# EAGLE design mainboard-dev (EAGLE 6.4)
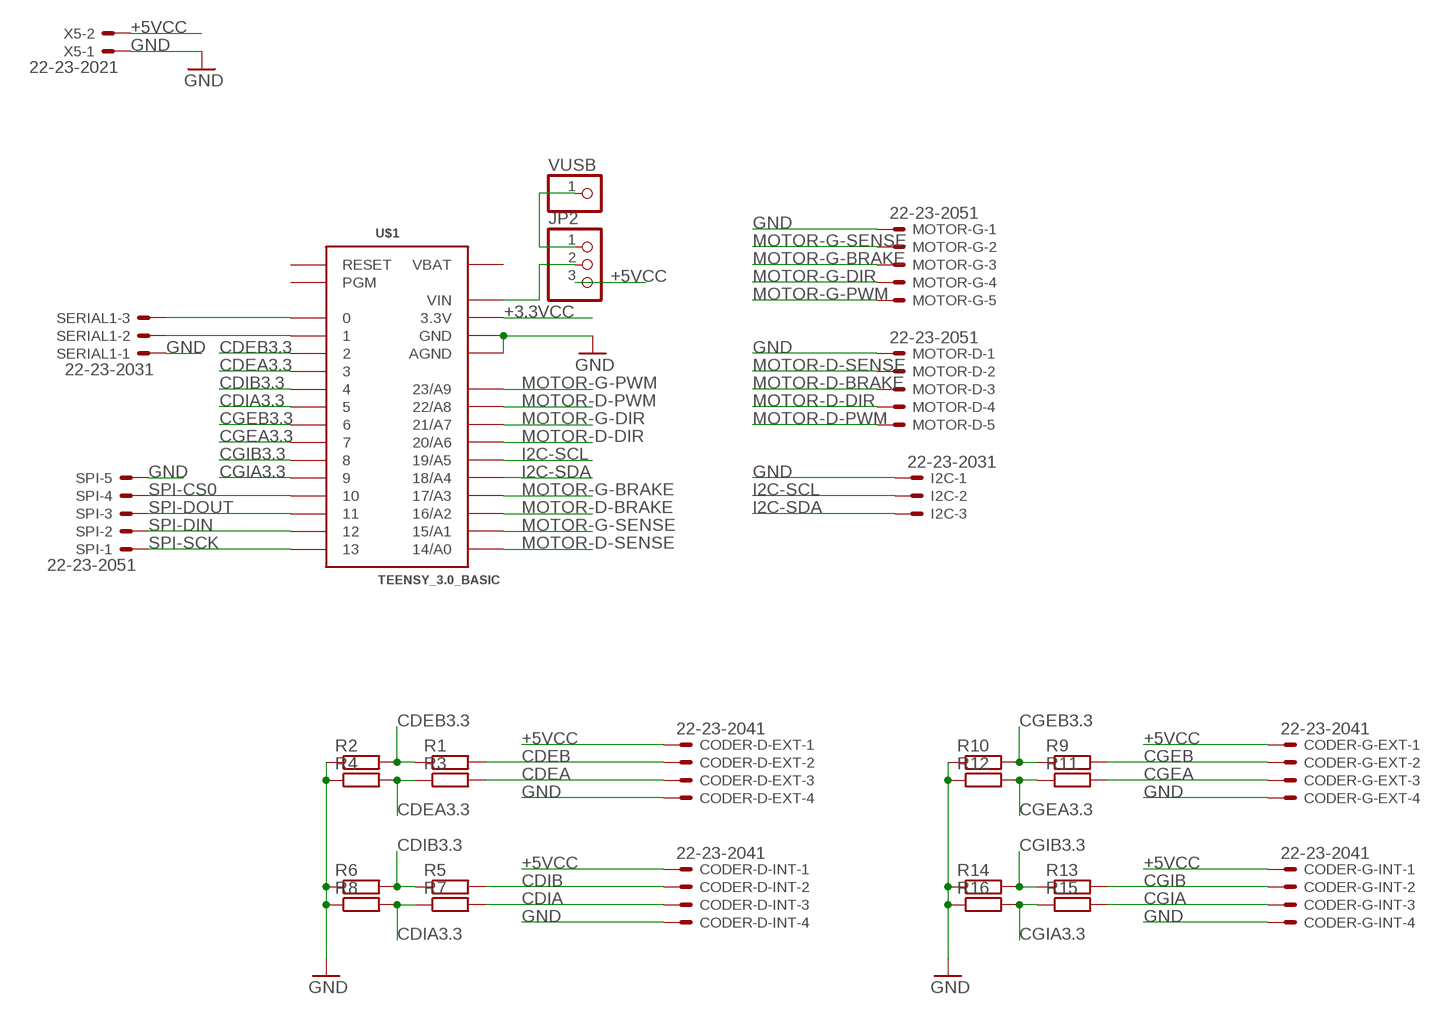
[diagram p0: schematic, sheet 1]

## Parts
CODER-D-EXT  22-23-2041  [22-23-2041]
CODER-D-INT  22-23-2041  [22-23-2041]
CODER-G-EXT  22-23-2041  [22-23-2041]
CODER-G-INT  22-23-2041  [22-23-2041]
I2C  22-23-2031  [22-23-2031]
JP2  PINHD-1X3  [1X03]
MOTOR-D  22-23-2051  [22-23-2051]
MOTOR-G  22-23-2051  [22-23-2051]
R1  R-EU_0207/10  [0207/10]
R2  R-EU_0207/10  [0207/10]
R3  R-EU_0207/10  [0207/10]
R4  R-EU_0207/10  [0207/10]
R5  R-EU_0207/10  [0207/10]
R6  R-EU_0207/10  [0207/10]
R7  R-EU_0207/10  [0207/10]
R8  R-EU_0207/10  [0207/10]
R9  R-EU_0207/10  [0207/10]
R10  R-EU_0207/10  [0207/10]
R11  R-EU_0207/10  [0207/10]
R12  R-EU_0207/10  [0207/10]
R13  R-EU_0207/10  [0207/10]
R14  R-EU_0207/10  [0207/10]
R15  R-EU_0207/10  [0207/10]
R16  R-EU_0207/10  [0207/10]
SERIAL1  22-23-2031  [22-23-2031]
SPI  22-23-2051  [22-23-2051]
U$1  TEENSY_3.0_BASIC  [TEENSY_3.0_BASIC]
VUSB  PINHD-1X1  [1X01]
X5  22-23-2021  [22-23-2021]

## Nets
+3.3VCC: U$1.3.3V U$1.3.3V1(3.3V)
+5VCC: CODER-D-EXT.1 CODER-D-INT.1 CODER-G-EXT.1 CODER-G-INT.1 JP2.3 X5.2
CDEA: CODER-D-EXT.3 R3.2
CDEA3.3: R3.1 R4.2 U$1.3
CDEB: CODER-D-EXT.2 R1.2
CDEB3.3: R1.1 R2.2 U$1.2
CDIA: CODER-D-INT.3 R7.2
CDIA3.3: R7.1 R8.2 U$1.5
CDIB: CODER-D-INT.2 R5.2
CDIB3.3: R5.1 R6.2 U$1.4
CGEA: CODER-G-EXT.3 R11.2
CGEA3.3: R11.1 R12.2 U$1.7
CGEB: CODER-G-EXT.2 R9.2
CGEB3.3: R9.1 R10.2 U$1.6
CGIA: CODER-G-INT.3 R15.2
CGIA3.3: R15.1 R16.2 U$1.9
CGIB: CODER-G-INT.2 R13.2
CGIB3.3: R13.1 R14.2 U$1.8
GND: CODER-D-EXT.4 CODER-D-INT.4 CODER-G-EXT.4 CODER-G-INT.4 I2C.1 MOTOR-D.1 MOTOR-G.1 R2.1 R4.1 R6.1 R8.1 R10.1 R12.1 R14.1 R16.1 SERIAL1.1 SPI.5 U$1.AGND U$1.GND U$1.GND1(GND) X5.1
I2C-SCL: I2C.2 U$1.19/A5
I2C-SDA: I2C.3 U$1.18/A4
MOTOR-D-BRAKE: MOTOR-D.3 U$1.16/A2
MOTOR-D-DIR: MOTOR-D.4 U$1.20/A6
MOTOR-D-PWM: MOTOR-D.5 U$1.22/A8
MOTOR-D-SENSE: MOTOR-D.2 U$1.14/A0
MOTOR-G-BRAKE: MOTOR-G.3 U$1.17/A3
MOTOR-G-DIR: MOTOR-G.4 U$1.21/A7
MOTOR-G-PWM: MOTOR-G.5 U$1.23/A9
MOTOR-G-SENSE: MOTOR-G.2 U$1.15/A1
N$1: SERIAL1.3 U$1.0
N$2: SERIAL1.2 U$1.1
N$3: JP2.2 U$1.VIN
N$4: JP2.1 VUSB.1
SPI-CS0: SPI.4 U$1.10
SPI-DIN: SPI.2 U$1.12
SPI-DOUT: SPI.3 U$1.11
SPI-SCK: SPI.1 U$1.13
Unconnected: U$1.PGM U$1.RESET

## Power pins joined to a net without a drawn wire
VBAT: U$1.VBAT

## Library data of the parts
CODER-D-EXT CODER-D-INT CODER-G-EXT CODER-G-INT = con-molex:22-23-2041: .100" (2.54mm) Center Header - 4 Pin; MF: MOLEX; MPN: 22-23-2041; OC_FARNELL: 1462920; OC_NEWARK: 38C0355
I2C SERIAL1 = con-molex:22-23-2031: .100" (2.54mm) Center Header - 3 Pin; MF: MOLEX; MPN: 22-23-2031; OC_FARNELL: 1462950; OC_NEWARK: 30C0862
JP2 = pinhead:PINHD-1X3: PIN HEADER
MOTOR-D MOTOR-G SPI = con-molex:22-23-2051: .100" (2.54mm) Center Header - 5 Pin; MF: MOLEX; MPN: 22-23-2051; OC_FARNELL: 1462952; OC_NEWARK: 38C9178
R1-R16 = rcl:R-EU_: RESISTOR, European symbol
U$1 = Teensy3.0:TEENSY_3.0_BASIC: Basic Teensy 3.0 with none of the 'inner' pins enabled. See '+4', 'AllAnalogPins", and 'AllPins' packages for additional pin holes, as needed.
VUSB = pinhead:PINHD-1X1: PIN HEADER
X5 = con-molex:22-23-2021: .100" (2.54mm) Center Header - 2 Pin; MF: MOLEX; MPN: 22-23-2021; OC_FARNELL: 1462926; OC_NEWARK: 25C3832

## Board
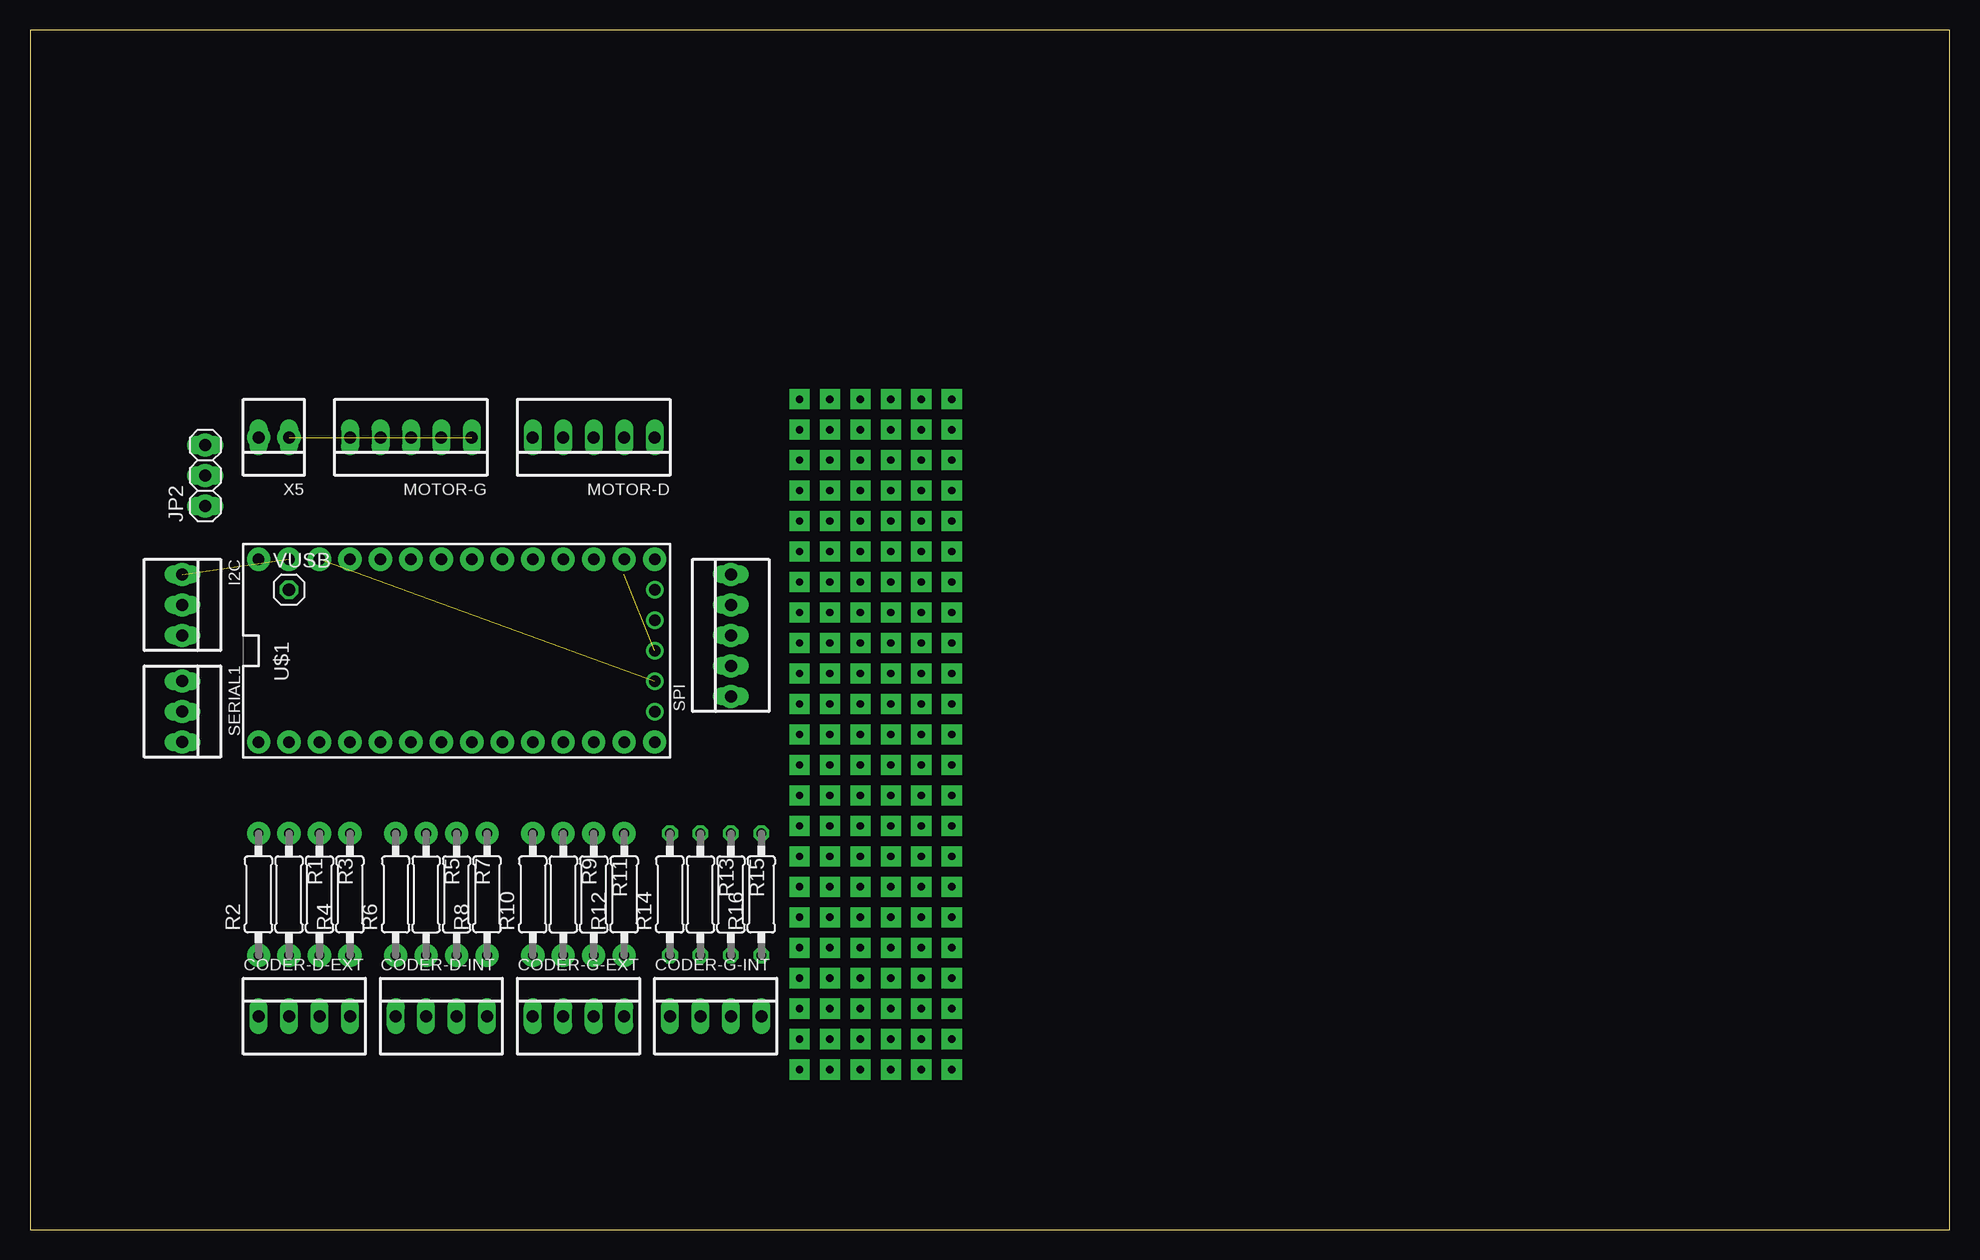
[diagram p1: board, top side]
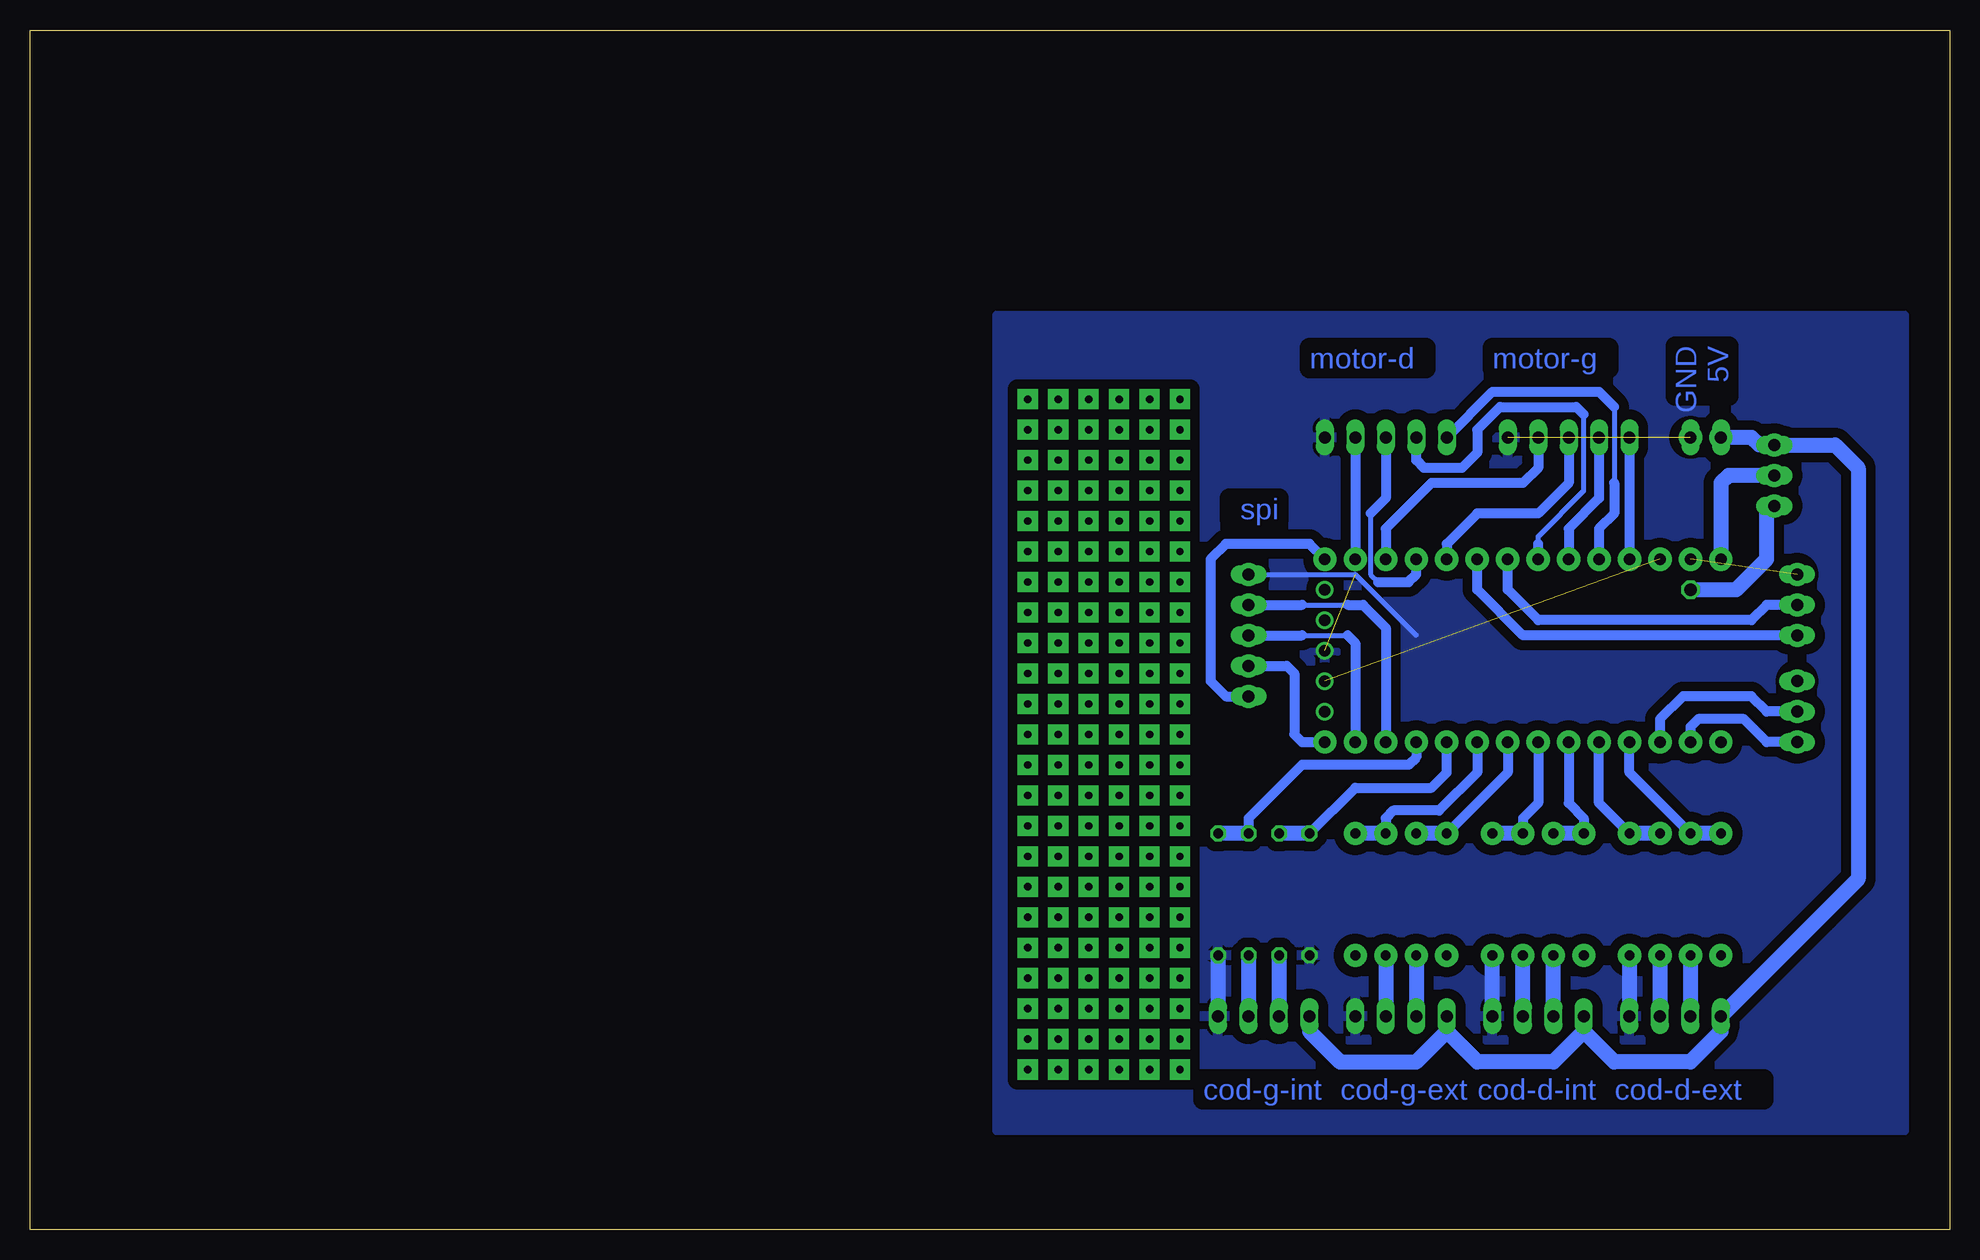
[diagram p2: board, bottom side, seen from below]

Size 160 x 100 mm. Coordinates in mm from the lower left corner, seen from the top.
Outline: 0,0 160,0 160,100 0,100 0,0
Copper layers (1*16): Top 0.035mm / dielectric 1.5mm / Bottom 0.035mm
Design rules "default": minimum track width 10mil, minimum drill 24mil, track to track 8mil, track to pad 8mil, pad to pad 8mil, via to via 8mil, smd to smd 8mil, copper to edge 40mil, drill to drill 8mil, minimum pad ring 10mil, minimum via ring 8mil, stop-mask expansion 4mil, vias tented up to drill 0mil, thermal gap 10mil

### Footprints (pad centres in the part's own frame; a part is rotated, then mirrored left to right if it is on the bottom)
22-23-2041 = drill 1 long: 1 -3.81,0; 2 -1.27,0; 3 1.27,0; 4 3.81,0
22-23-2031 = drill 1 long: 1 -2.54,0; 2 0,0; 3 2.54,0
1X03 = drill 1.016 long: 1 -2.54,0; 2 0,0; 3 2.54,0
22-23-2051 = drill 1 long: 1 -5.08,0; 2 -2.54,0; 3 0,0; 4 2.54,0; 5 5.08,0
0207/10 = drill 0.813 octagon: 1 -5.08,0; 2 5.08,0
TEENSY_3.0_BASIC = drill 0.965: 0 -7.62,13.97; 1 -7.62,11.43; 2 -7.62,8.89; 3 -7.62,6.35; 3.3V 7.62,11.43; 3.3V1 -2.54,-16.51; 4 -7.62,3.81; 5 -7.62,1.27; 6 -7.62,-1.27; 7 -7.62,-3.81; 8 -7.62,-6.35; 9 -7.62,-8.89; 10 -7.62,-11.43; 11 -7.62,-13.97; 12 -7.62,-16.51; 13 7.62,-16.51; 14/A0 7.62,-13.97; 15/A1 7.62,-11.43; 16/A2 7.62,-8.89; 17/A3 7.62,-6.35; 18/A4 7.62,-3.81; 19/A5 7.62,-1.27; 20/A6 7.62,1.27; 21/A7 7.62,3.81; 22/A8 7.62,6.35; 23/A9 7.62,8.89; AGND 7.62,13.97; GND -7.62,16.51; GND1 0,-16.51; PGM 2.54,-16.51; RESET 5.08,-16.51; VBAT -5.08,-16.51; VIN 7.62,16.51
1X01 = drill 1.016 octagon: 1 0,0
22-23-2021 = drill 1 long: 1 -1.27,0; 2 1.27,0

### Placement (x,y rotation side)
CODER-D-EXT  22.86,17.78 0 top
CODER-D-INT  34.29,17.78 0 top
CODER-G-EXT  45.72,17.78 0 top
CODER-G-INT  57.15,17.78 0 top
I2C  12.7,52.07 270 top
JP2  14.61,62.87 90 top
MOTOR-D  46.99,66.04 180 top
MOTOR-G  31.75,66.04 180 top
R1  21.59,27.94 270 top
R2  19.05,27.94 90 top
R3  24.13,27.94 270 top
R4  26.67,27.94 90 top
R5  33.02,27.94 270 top
R6  30.48,27.94 90 top
R7  35.56,27.94 270 top
R8  38.1,27.94 90 top
R9  44.45,27.94 270 top
R10  41.91,27.94 90 top
R11  46.99,27.94 270 top
R12  49.53,27.94 90 top
R13  55.88,27.94 270 top
R14  53.34,27.94 90 top
R15  58.42,27.94 270 top
R16  60.96,27.94 90 top
SERIAL1  12.7,43.18 270 top
SPI  58.42,49.53 90 top
U$1  35.56,48.26 90 top
VUSB  21.59,53.34 0 top
X5  20.32,66.04 180 top

### Tracks (layer width: path | path; a pad name or v marks a point on that pad's centre or on a via)
+3.3VCC  (1 unrouted)
+5VCC
  Bottom 1.27: X5.2 16.51,66.04 15.88,65.41 JP2.3 9.53,65.41 7.62,63.5 7.62,29.21 CODER-D-EXT.1 19.05,16.51 21.59,13.97 27.94,13.97 30.48,16.51 | CODER-G-INT.1 53.34,16.51 50.8,13.97 44.45,13.97 41.91,16.51 | 41.91,16.51 CODER-G-EXT.1 | CODER-D-INT.1 30.48,16.51 | 30.48,16.51 33.02,13.97 39.37,13.97 41.91,16.51
CDEA
  Bottom 1.27: R3.2 CODER-D-EXT.3
CDEA3.3
  Bottom 0.813: R4.2 29.21,35.56 U$1.3
  Bottom 1.27: R3.1 R4.2
CDEB
  Bottom 1.27: R1.2 CODER-D-EXT.2
CDEB3.3
  Bottom 0.813: R1.1 26.67,38.1 U$1.2
  Bottom 1.27: R2.2 R1.1
CDIA
  Bottom 1.27: CODER-D-INT.3 R7.2
CDIA3.3
  Bottom 0.813: U$1.5 34.29,35.56 35.56,34.29 R7.1
  Bottom 1.27: R7.1 R8.2
CDIB
  Bottom 1.27: CODER-D-INT.2 R5.2
CDIB3.3
  Bottom 0.813: U$1.4 31.75,35.56 30.48,34.29 R6.2
  Bottom 1.27: R6.2 R5.1
CGEA
  Bottom 1.27: R11.2 CODER-G-EXT.3
CGEA3.3
  Bottom 0.813: U$1.7 39.37,38.1 42.55,34.92 46.35,34.92 46.99,34.29 R11.1
  Bottom 1.27: R11.1 R12.2
CGEB
  Bottom 1.27: R9.2 CODER-G-EXT.2
CGEB3.3
  Bottom 0.813: U$1.6 36.83,38.1 R10.2
  Bottom 1.27: R10.2 R9.1
CGIA
  Bottom 1.27: R15.2 CODER-G-INT.3
CGIA3.3
  Bottom 0.813: U$1.9 44.45,39.37 45.09,38.73 53.98,38.73 58.42,34.29 R15.1
  Bottom 1.27: R15.1 R16.2
CGIB
  Bottom 1.27: R13.2 CODER-G-INT.2
CGIB3.3
  Bottom 0.813: R14.2 49.53,36.83 43.18,36.83 41.91,38.1 U$1.8
  Bottom 1.27: R14.2 R13.1
GND  (3 unrouted)
  Bottom 0.406: SPI.5 49.53,54.61 44.45,49.53
  Bottom 1.27: R4.1 CODER-D-EXT.4 | R16.1 CODER-G-INT.4 | CODER-D-INT.4 R8.1
  pour Bottom (isolate 0.813): 3.81,76.2 3.81,8.26 79.38,8.26 79.38,76.2
I2C-SCL
  Bottom 0.813: U$1.19/A5 36.83,53.34 34.29,50.8 16.51,50.8 15.24,52.07 I2C.2
I2C-SDA
  Bottom 0.813: I2C.3 35.56,49.53 39.37,53.34 U$1.18/A4
MOTOR-D-BRAKE
  Bottom 0.406: 48.26,59.69 48.26,54.61 47.62,53.98
  Bottom 0.813: MOTOR-D.3 46.99,60.96 48.26,59.69 | 47.62,53.98 45.09,53.98 44.45,54.61 U$1.16/A2
MOTOR-D-DIR
  Bottom 0.406: 34.29,57.15 34.29,57.78 30.48,61.59 30.48,67.94
  Bottom 0.813: U$1.20/A6 34.29,57.15 | MOTOR-D.4 44.45,64.14 43.81,63.5 40.64,63.5 39.37,64.77 39.37,66.67 37.47,68.58 31.11,68.58 30.48,67.94
MOTOR-D-PWM
  Bottom 0.406: 27.94,68.58 27.94,62.23
  Bottom 0.813: MOTOR-D.5 38.1,69.85 29.21,69.85 27.94,68.58 | 27.94,62.23 27.94,59.69 29.21,58.42 U$1.22/A8
MOTOR-D-SENSE
  Bottom 0.813: MOTOR-D.2 U$1.14/A0
MOTOR-G-BRAKE
  Bottom 0.813: MOTOR-G.3 31.75,62.23 34.29,59.69 39.37,59.69 41.91,57.15 U$1.17/A3
MOTOR-G-DIR
  Bottom 0.813: MOTOR-G.4 29.21,60.96 31.75,58.42 U$1.21/A7
MOTOR-G-PWM
  Bottom 0.813: MOTOR-G.5 U$1.23/A9
MOTOR-G-SENSE
  Bottom 0.813: MOTOR-G.2 34.29,63.5 35.56,62.23 43.18,62.23 46.99,58.42 U$1.15/A1
N$1
  Bottom 0.813: SERIAL1.3 15.24,40.64 17.14,42.55 20.95,42.55 21.59,41.91 U$1.0
N$2
  Bottom 0.813: SERIAL1.2 15.24,43.18 16.51,44.45 22.23,44.45 24.13,42.55 U$1.1
N$3
  Bottom 1.27: JP2.2 18.41,62.87 19.05,62.23 U$1.VIN
N$4
  Bottom 1.27: VUSB.1 17.78,53.34 15.24,55.88 15.24,59.69 JP2.1
N$5  (via drill 0.6 pad 1.68)
  other vias: 64.14,69.22
N$6  (via drill 0.6 pad 1.68)
  other vias: 66.67,69.22
N$7  (via drill 0.6 pad 1.68)
  other vias: 69.22,69.22
N$8  (via drill 0.6 pad 1.68)
  other vias: 71.75,69.22
N$9  (via drill 0.6 pad 1.68)
  other vias: 74.3,69.22
N$10  (via drill 0.6 pad 1.68)
  other vias: 76.83,69.22
N$11  (via drill 0.6 pad 1.68)
  other vias: 64.14,66.67
N$12  (via drill 0.6 pad 1.68)
  other vias: 66.67,66.67
N$13  (via drill 0.6 pad 1.68)
  other vias: 69.22,66.67
N$14  (via drill 0.6 pad 1.68)
  other vias: 71.75,66.67
N$15  (via drill 0.6 pad 1.68)
  other vias: 74.3,66.67
N$16  (via drill 0.6 pad 1.68)
  other vias: 76.83,66.67
N$17  (via drill 0.6 pad 1.68)
  other vias: 64.14,64.14
N$18  (via drill 0.6 pad 1.68)
  other vias: 66.67,64.14
N$19  (via drill 0.6 pad 1.68)
  other vias: 69.22,64.14
N$20  (via drill 0.6 pad 1.68)
  other vias: 71.75,64.14
N$21  (via drill 0.6 pad 1.68)
  other vias: 74.3,64.14
N$22  (via drill 0.6 pad 1.68)
  other vias: 76.83,64.14
N$23  (via drill 0.6 pad 1.68)
  other vias: 64.14,61.59
N$24  (via drill 0.6 pad 1.68)
  other vias: 66.67,61.59
N$25  (via drill 0.6 pad 1.68)
  other vias: 69.22,61.59
N$26  (via drill 0.6 pad 1.68)
  other vias: 71.75,61.59
N$27  (via drill 0.6 pad 1.68)
  other vias: 74.3,61.59
N$28  (via drill 0.6 pad 1.68)
  other vias: 76.83,61.59
N$29  (via drill 0.6 pad 1.68)
  other vias: 64.14,59.05
N$30  (via drill 0.6 pad 1.68)
  other vias: 66.67,59.05
N$31  (via drill 0.6 pad 1.68)
  other vias: 69.22,59.05
N$32  (via drill 0.6 pad 1.68)
  other vias: 71.75,59.05
N$33  (via drill 0.6 pad 1.68)
  other vias: 74.3,59.05
N$34  (via drill 0.6 pad 1.68)
  other vias: 76.83,59.05
N$35  (via drill 0.6 pad 1.68)
  other vias: 64.14,56.52
N$36  (via drill 0.6 pad 1.68)
  other vias: 66.67,56.52
N$37  (via drill 0.6 pad 1.68)
  other vias: 69.22,56.52
N$38  (via drill 0.6 pad 1.68)
  other vias: 71.75,56.52
N$39  (via drill 0.6 pad 1.68)
  other vias: 74.3,56.52
N$40  (via drill 0.6 pad 1.68)
  other vias: 76.83,56.52
N$41  (via drill 0.6 pad 1.68)
  other vias: 64.14,53.98
N$42  (via drill 0.6 pad 1.68)
  other vias: 66.67,53.98
N$43  (via drill 0.6 pad 1.68)
  other vias: 69.22,53.98
N$44  (via drill 0.6 pad 1.68)
  other vias: 71.75,53.98
N$45  (via drill 0.6 pad 1.68)
  other vias: 74.3,53.98
N$46  (via drill 0.6 pad 1.68)
  other vias: 76.83,53.98
N$47  (via drill 0.6 pad 1.68)
  other vias: 64.14,51.44
N$48  (via drill 0.6 pad 1.68)
  other vias: 66.67,51.44
N$49  (via drill 0.6 pad 1.68)
  other vias: 69.22,51.44
N$50  (via drill 0.6 pad 1.68)
  other vias: 71.75,51.44
N$51  (via drill 0.6 pad 1.68)
  other vias: 74.3,51.44
N$52  (via drill 0.6 pad 1.68)
  other vias: 76.83,51.44
N$53  (via drill 0.6 pad 1.68)
  other vias: 64.14,48.9
N$54  (via drill 0.6 pad 1.68)
  other vias: 66.67,48.9
N$55  (via drill 0.6 pad 1.68)
  other vias: 69.22,48.9
N$56  (via drill 0.6 pad 1.68)
  other vias: 71.75,48.9
N$57  (via drill 0.6 pad 1.68)
  other vias: 74.3,48.9
N$58  (via drill 0.6 pad 1.68)
  other vias: 76.83,48.9
N$59  (via drill 0.6 pad 1.68)
  other vias: 64.14,46.35
N$60  (via drill 0.6 pad 1.68)
  other vias: 66.67,46.35
N$61  (via drill 0.6 pad 1.68)
  other vias: 69.22,46.35
N$62  (via drill 0.6 pad 1.68)
  other vias: 71.75,46.35
N$63  (via drill 0.6 pad 1.68)
  other vias: 74.3,46.35
N$64  (via drill 0.6 pad 1.68)
  other vias: 76.83,46.35
N$65  (via drill 0.6 pad 1.68)
  other vias: 64.14,43.81
N$66  (via drill 0.6 pad 1.68)
  other vias: 66.67,43.81
N$67  (via drill 0.6 pad 1.68)
  other vias: 69.22,43.81
N$68  (via drill 0.6 pad 1.68)
  other vias: 71.75,43.81
N$69  (via drill 0.6 pad 1.68)
  other vias: 74.3,43.81
N$70  (via drill 0.6 pad 1.68)
  other vias: 76.83,43.81
N$71  (via drill 0.6 pad 1.68)
  other vias: 64.14,41.27
N$72  (via drill 0.6 pad 1.68)
  other vias: 66.67,41.27
N$73  (via drill 0.6 pad 1.68)
  other vias: 69.22,41.27
N$74  (via drill 0.6 pad 1.68)
  other vias: 71.75,41.27
N$75  (via drill 0.6 pad 1.68)
  other vias: 74.3,41.27
N$76  (via drill 0.6 pad 1.68)
  other vias: 76.83,41.27
N$77  (via drill 0.6 pad 1.68)
  other vias: 64.14,38.73
N$78  (via drill 0.6 pad 1.68)
  other vias: 66.67,38.73
N$79  (via drill 0.6 pad 1.68)
  other vias: 69.22,38.73
N$80  (via drill 0.6 pad 1.68)
  other vias: 71.75,38.73
N$81  (via drill 0.6 pad 1.68)
  other vias: 74.3,38.73
N$82  (via drill 0.6 pad 1.68)
  other vias: 76.83,38.73
N$83  (via drill 0.6 pad 1.68)
  other vias: 64.14,36.2
N$84  (via drill 0.6 pad 1.68)
  other vias: 66.67,36.2
N$85  (via drill 0.6 pad 1.68)
  other vias: 69.22,36.2
N$86  (via drill 0.6 pad 1.68)
  other vias: 71.75,36.2
N$87  (via drill 0.6 pad 1.68)
  other vias: 74.3,36.2
N$88  (via drill 0.6 pad 1.68)
  other vias: 76.83,36.2
N$89  (via drill 0.6 pad 1.68)
  other vias: 64.14,33.66
N$90  (via drill 0.6 pad 1.68)
  other vias: 66.67,33.66
N$91  (via drill 0.6 pad 1.68)
  other vias: 69.22,33.66
N$92  (via drill 0.6 pad 1.68)
  other vias: 71.75,33.66
N$93  (via drill 0.6 pad 1.68)
  other vias: 74.3,33.66
N$94  (via drill 0.6 pad 1.68)
  other vias: 76.83,33.66
N$95  (via drill 0.6 pad 1.68)
  other vias: 64.14,31.11
N$96  (via drill 0.6 pad 1.68)
  other vias: 66.67,31.11
N$97  (via drill 0.6 pad 1.68)
  other vias: 69.22,31.11
N$98  (via drill 0.6 pad 1.68)
  other vias: 71.75,31.11
N$99  (via drill 0.6 pad 1.68)
  other vias: 74.3,31.11
N$100  (via drill 0.6 pad 1.68)
  other vias: 76.83,31.11
N$101  (via drill 0.6 pad 1.68)
  other vias: 64.14,28.57
N$102  (via drill 0.6 pad 1.68)
  other vias: 66.67,28.57
N$103  (via drill 0.6 pad 1.68)
  other vias: 69.22,28.57
N$104  (via drill 0.6 pad 1.68)
  other vias: 71.75,28.57
N$105  (via drill 0.6 pad 1.68)
  other vias: 74.3,28.57
N$106  (via drill 0.6 pad 1.68)
  other vias: 76.83,28.57
N$107  (via drill 0.6 pad 1.68)
  other vias: 64.14,26.04
N$108  (via drill 0.6 pad 1.68)
  other vias: 66.67,26.04
N$109  (via drill 0.6 pad 1.68)
  other vias: 69.22,26.04
N$110  (via drill 0.6 pad 1.68)
  other vias: 71.75,26.04
N$111  (via drill 0.6 pad 1.68)
  other vias: 74.3,26.04
N$112  (via drill 0.6 pad 1.68)
  other vias: 76.83,26.04
N$113  (via drill 0.6 pad 1.68)
  other vias: 64.14,23.5
N$114  (via drill 0.6 pad 1.68)
  other vias: 66.67,23.5
N$115  (via drill 0.6 pad 1.68)
  other vias: 69.22,23.5
N$116  (via drill 0.6 pad 1.68)
  other vias: 71.75,23.5
N$117  (via drill 0.6 pad 1.68)
  other vias: 74.3,23.5
N$118  (via drill 0.6 pad 1.68)
  other vias: 76.83,23.5
N$119  (via drill 0.6 pad 1.68)
  other vias: 64.14,20.95
N$120  (via drill 0.6 pad 1.68)
  other vias: 66.67,20.95
N$121  (via drill 0.6 pad 1.68)
  other vias: 69.22,20.95
N$122  (via drill 0.6 pad 1.68)
  other vias: 71.75,20.95
N$123  (via drill 0.6 pad 1.68)
  other vias: 74.3,20.95
N$124  (via drill 0.6 pad 1.68)
  other vias: 76.83,20.95
N$125  (via drill 0.6 pad 1.68)
  other vias: 64.14,18.41
N$126  (via drill 0.6 pad 1.68)
  other vias: 66.67,18.41
N$127  (via drill 0.6 pad 1.68)
  other vias: 69.22,18.41
N$128  (via drill 0.6 pad 1.68)
  other vias: 71.75,18.41
N$129  (via drill 0.6 pad 1.68)
  other vias: 74.3,18.41
N$130  (via drill 0.6 pad 1.68)
  other vias: 76.83,18.41
N$131  (via drill 0.6 pad 1.68)
  other vias: 64.14,15.88
N$132  (via drill 0.6 pad 1.68)
  other vias: 66.67,15.88
N$133  (via drill 0.6 pad 1.68)
  other vias: 69.22,15.88
N$134  (via drill 0.6 pad 1.68)
  other vias: 71.75,15.88
N$135  (via drill 0.6 pad 1.68)
  other vias: 74.3,15.88
N$136  (via drill 0.6 pad 1.68)
  other vias: 76.83,15.88
N$137  (via drill 0.6 pad 1.68)
  other vias: 64.14,13.34
N$138  (via drill 0.6 pad 1.68)
  other vias: 66.67,13.34
N$139  (via drill 0.6 pad 1.68)
  other vias: 69.22,13.34
N$140  (via drill 0.6 pad 1.68)
  other vias: 71.75,13.34
N$141  (via drill 0.6 pad 1.68)
  other vias: 74.3,13.34
N$142  (via drill 0.6 pad 1.68)
  other vias: 76.83,13.34
N$143  (via drill 0.6 pad 1.93)
  other vias: 19.05,55.88
N$144  (via drill 0.6 pad 1.93)
  other vias: 21.59,55.88
N$145  (via drill 0.6 pad 1.93)
  other vias: 24.13,55.88
N$146  (via drill 0.6 pad 1.93)
  other vias: 26.67,55.88
N$147  (via drill 0.6 pad 1.93)
  other vias: 29.21,55.88
N$148  (via drill 0.6 pad 1.93)
  other vias: 31.75,55.88
N$149  (via drill 0.6 pad 1.93)
  other vias: 34.29,55.88
N$150  (via drill 0.6 pad 1.93)
  other vias: 36.83,55.88
N$151  (via drill 0.6 pad 1.93)
  other vias: 39.37,55.88
N$152  (via drill 0.6 pad 1.93)
  other vias: 41.91,55.88
N$153  (via drill 0.6 pad 1.93)
  other vias: 44.45,55.88
N$154  (via drill 0.6 pad 1.93)
  other vias: 46.99,55.88
N$155  (via drill 0.6 pad 1.93)
  other vias: 49.53,55.88
N$156  (via drill 0.6 pad 1.93)
  other vias: 52.07,55.88
N$157  (via drill 0.6 pad 1.93)
  other vias: 52.07,40.64
N$158  (via drill 0.6 pad 1.93)
  other vias: 49.53,40.64
N$159  (via drill 0.6 pad 1.93)
  other vias: 46.99,40.64
N$160  (via drill 0.6 pad 1.93)
  other vias: 44.45,40.64
N$161  (via drill 0.6 pad 1.93)
  other vias: 41.91,40.64
N$162  (via drill 0.6 pad 1.93)
  other vias: 39.37,40.64
N$163  (via drill 0.6 pad 1.93)
  other vias: 36.83,40.64
N$164  (via drill 0.6 pad 1.93)
  other vias: 34.29,40.64
N$165  (via drill 0.6 pad 1.93)
  other vias: 31.75,40.64
N$166  (via drill 0.6 pad 1.93)
  other vias: 29.21,40.64
N$167  (via drill 0.6 pad 1.93)
  other vias: 26.67,40.64
N$168  (via drill 0.6 pad 1.93)
  other vias: 24.13,40.64
N$169  (via drill 0.6 pad 1.93)
  other vias: 21.59,40.64
N$170  (via drill 0.6 pad 1.93)
  other vias: 19.05,40.64
N$171  (via drill 0.6 pad 1.93)
  other vias: 19.05,33.02
N$172  (via drill 0.6 pad 1.93)
  other vias: 21.59,33.02
N$173  (via drill 0.6 pad 1.93)
  other vias: 24.13,33.02
N$174  (via drill 0.6 pad 1.93)
  other vias: 26.67,33.02
N$175  (via drill 0.6 pad 1.93)
  other vias: 30.48,33.02
N$176  (via drill 0.6 pad 1.93)
  other vias: 33.02,33.02
N$177  (via drill 0.6 pad 1.93)
  other vias: 35.56,33.02
N$178  (via drill 0.6 pad 1.93)
  other vias: 38.1,33.02
N$179  (via drill 0.6 pad 1.93)
  other vias: 41.91,33.02
N$180  (via drill 0.6 pad 1.93)
  other vias: 44.45,33.02
N$181  (via drill 0.6 pad 1.93)
  other vias: 46.99,33.02
N$182  (via drill 0.6 pad 1.93)
  other vias: 49.53,33.02
N$183  (via drill 0.6 pad 1.93)
  other vias: 19.05,22.86
N$184  (via drill 0.6 pad 1.93)
  other vias: 21.59,22.86
N$185  (via drill 0.6 pad 1.93)
  other vias: 24.13,22.86
N$186  (via drill 0.6 pad 1.93)
  other vias: 26.67,22.86
N$187  (via drill 0.6 pad 1.93)
  other vias: 30.48,22.86
N$188  (via drill 0.6 pad 1.93)
  other vias: 33.02,22.86
N$189  (via drill 0.6 pad 1.93)
  other vias: 35.56,22.86
N$190  (via drill 0.6 pad 1.93)
  other vias: 38.1,22.86
N$191  (via drill 0.6 pad 1.93)
  other vias: 41.91,22.86
N$192  (via drill 0.6 pad 1.93)
  other vias: 44.45,22.86
N$193  (via drill 0.6 pad 1.93)
  other vias: 46.99,22.86
N$194  (via drill 0.6 pad 1.93)
  other vias: 49.53,22.86
N$195  (via drill 0.6 pad 1.93)
  other vias: 14.61,65.41
N$196  (via drill 0.6 pad 1.93)
  other vias: 14.61,62.87
N$197  (via drill 0.6 pad 1.93)
  other vias: 14.61,60.33
N$198  (via drill 0.6 pad 1.93)
  other vias: 12.7,54.61
N$199  (via drill 0.6 pad 1.93)
  other vias: 12.7,52.07
N$200  (via drill 0.6 pad 1.93)
  other vias: 12.7,49.53
N$201  (via drill 0.6 pad 1.93)
  other vias: 12.7,45.72
N$202  (via drill 0.6 pad 1.93)
  other vias: 12.7,43.18
N$203  (via drill 0.6 pad 1.93)
  other vias: 12.7,40.64
N$204  (via drill 0.6 pad 1.93)
  other vias: 19.05,66.04
N$205  (via drill 0.6 pad 1.93)
  other vias: 21.59,66.04
N$206  (via drill 0.6 pad 1.93)
  other vias: 58.42,54.61
N$207  (via drill 0.6 pad 1.93)
  other vias: 58.42,52.07
N$208  (via drill 0.6 pad 1.93)
  other vias: 58.42,49.53
N$209  (via drill 0.6 pad 1.93)
  other vias: 58.42,46.99
N$210  (via drill 0.6 pad 1.93)
  other vias: 58.42,44.45
SPI-CS0
  Bottom 0.406: 53.98,52.07 50.16,52.07
  Bottom 0.813: SPI.4 53.98,52.07 | 50.16,52.07 48.9,52.07 46.99,50.16 U$1.10
SPI-DIN
  Bottom 0.813: SPI.2 55.24,46.99 54.61,46.35 54.61,41.27 53.98,40.64 U$1.12
SPI-DOUT
  Bottom 0.406: 53.98,49.53 50.16,49.53
  Bottom 0.813: SPI.3 53.98,49.53 | 50.16,49.53 49.53,48.9 U$1.11
SPI-SCK
  Bottom 0.813: U$1.13 53.34,57.15 60.33,57.15 61.59,55.88 61.59,45.72 60.33,44.45 SPI.1

### Text on the board
Bottom: GND / 5V | motor-g | motor-d | spi | cod-d-ext | cod-d-int | cod-g-ext | cod-g-int